# Altium schematic sheet Внешние разъемы.SchDoc
size 209 x 297 mm; Scale: 1:1; Разраб.: Иванов; Обозначение документа: АБВГ.123456.001 Э3; Пров.: Петров; Утв.: Сидоров; Наименование организации: ОАО "Концерн "МПО-Гидроприбор"; Перв. применение: АБВГ.123456.000; Наименование изделия 1: Плата; Наименование изделия 2: Схема электрическая; Наименование изделия 3: принципиальная; Нач. отд.: Нач. отд.; Фамилия нач. отд.: Сидоров
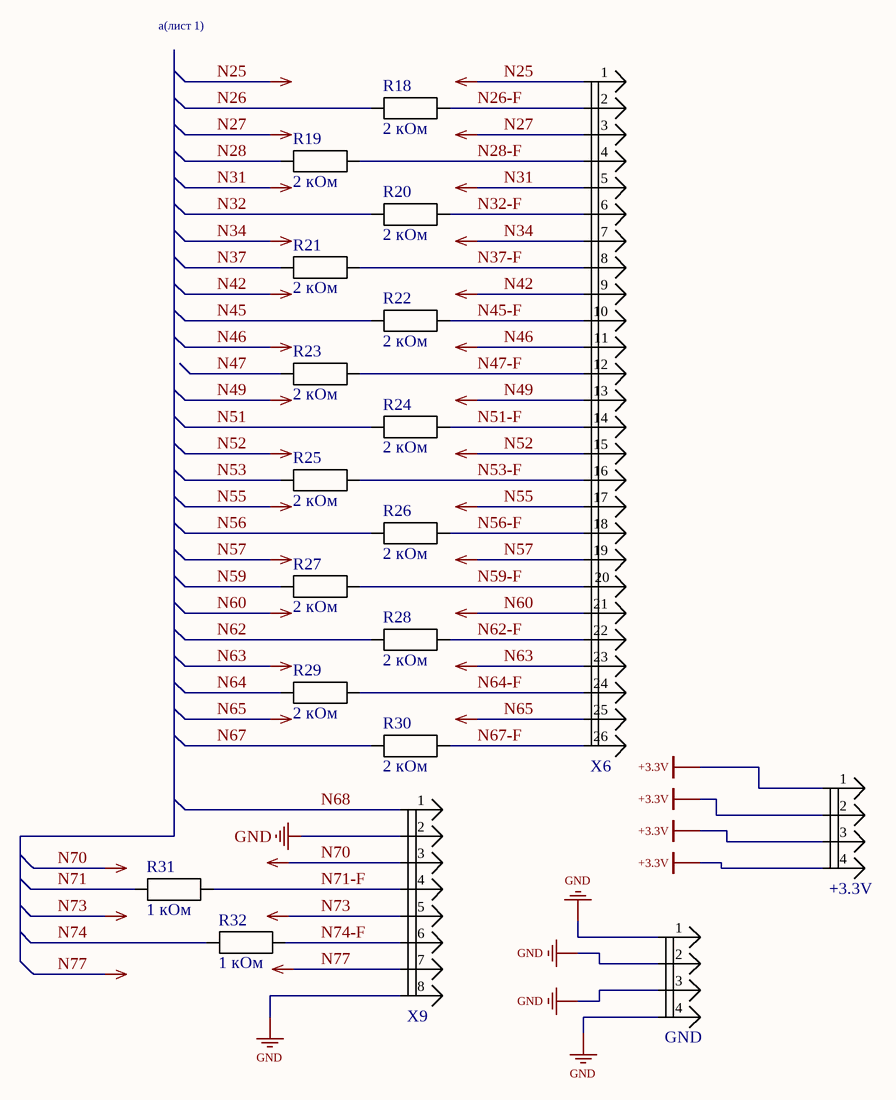
[diagram p0: Внешние разъемы.SchDoc]

## Parts
+3.3V  (no value)  [СНП346-4ВП21-1]
GND  (no value)  [СНП346-4ВП21-1]
R18  2 кОм  [Р1-12-0,125]
R19  2 кОм  [Р1-12-0,125]
R20  2 кОм  [Р1-12-0,125]
R21  2 кОм  [Р1-12-0,125]
R22  2 кОм  [Р1-12-0,125]
R23  2 кОм  [Р1-12-0,125]
R24  2 кОм  [Р1-12-0,125]
R25  2 кОм  [Р1-12-0,125]
R26  2 кОм  [Р1-12-0,125]
R27  2 кОм  [Р1-12-0,125]
R28  2 кОм  [Р1-12-0,125]
R29  2 кОм  [Р1-12-0,125]
R30  2 кОм  [Р1-12-0,125]
R31  1 кОм  [Р1-12-0,125]
R32  1 кОм  [Р1-12-0,125]
X6  (no value)  [СНП346-26ВП21-2]
X9  (no value)  [СНП346-8ВП21-2]

## Nets
+3.3V: +3.3V.1 +3.3V.2 +3.3V.3 +3.3V.4
GND: GND.1 GND.2 GND.3 GND.4 X9.2 X9.8
N25: X6.1 X6.3 X6.5 X6.7 X6.9 X6.11 X6.13 X6.15 X6.17 X6.19 X6.21 X6.23 X6.25 X9.3 X9.5 X9.7  [also labelled N27, N31, N34, N42, N46, N49, N52, N55, N57, N60, N63, N65, N70, N73, N77]
N26: R18.1
N26-F: R18.2 X6.2
N28: R19.1
N28-F: R19.2 X6.4
N32: R20.1
N32-F: R20.2 X6.6
N37: R21.1
N37-F: R21.2 X6.8
N45: R22.1
N45-F: R22.2 X6.10
N47: R23.1
N47-F: R23.2 X6.12
N51: R24.1
N51-F: R24.2 X6.14
N53: R25.1
N53-F: R25.2 X6.16
N56: R26.1
N56-F: R26.2 X6.18
N59: R27.1
N59-F: R27.2 X6.20
N62: R28.1
N62-F: R28.2 X6.22
N64: R29.1
N64-F: R29.2 X6.24
N67: R30.1
N67-F: R30.2 X6.26
N68: X9.1
N71: R31.1
N71-F: R31.2 X9.4
N74: R32.1
N74-F: R32.2 X9.6

## Notes on the sheet
- а(лист 1)
- Перв. примен.
- Справ. №
- Подп. и дата
- Инв. № дубл.
- Взам. инв. №
- Разраб.
- Изм.
- Лист
- № докум.
- Подп.
- Дата
- Лит.
- Масса
- Масштаб
- Пров.
- Т.контр.
- Листов
- Инв. № подл.
- Утв.
- Н.контр.
- Копировал
- Формат А4

## Library data of the parts
+3.3V GND = СНП346-4ВП21-1: PartNumber: РЮМК.430420.011ТУ; ManufacturerPartNumber: Вилка СНП346-4ВП21-1; Category: Соединитель
R18-R32 = Р1-12-0,125-1,5 кОм±1%: PartNumber: АЛЯР.434110.005 ТУ; ManufacturerPartNumber: Р1-12-0,125-1,5 кОм±1%-Л; Tolerance: ±1%-Л; Power/Voltage: 0,125; Category: Резистор
  R18-R30: Value: 2 кОм
  R31 R32: Value: 1 кОм
X6 = СНП346-26ВП21-2_1_1: PartNumber: РЮМК.430420.011ТУ; ManufacturerPartNumber: Вилка СНП346-10ВП21-2; Category: Соединитель
X9 = СНП346-8ВП21-2: PartNumber: РЮМК.430420.011ТУ; ManufacturerPartNumber: Вилка СНП346-8ВП21-2; Category: Соединитель